# EAGLE design TwoArmedBandit_old (EAGLE 9.6.2)
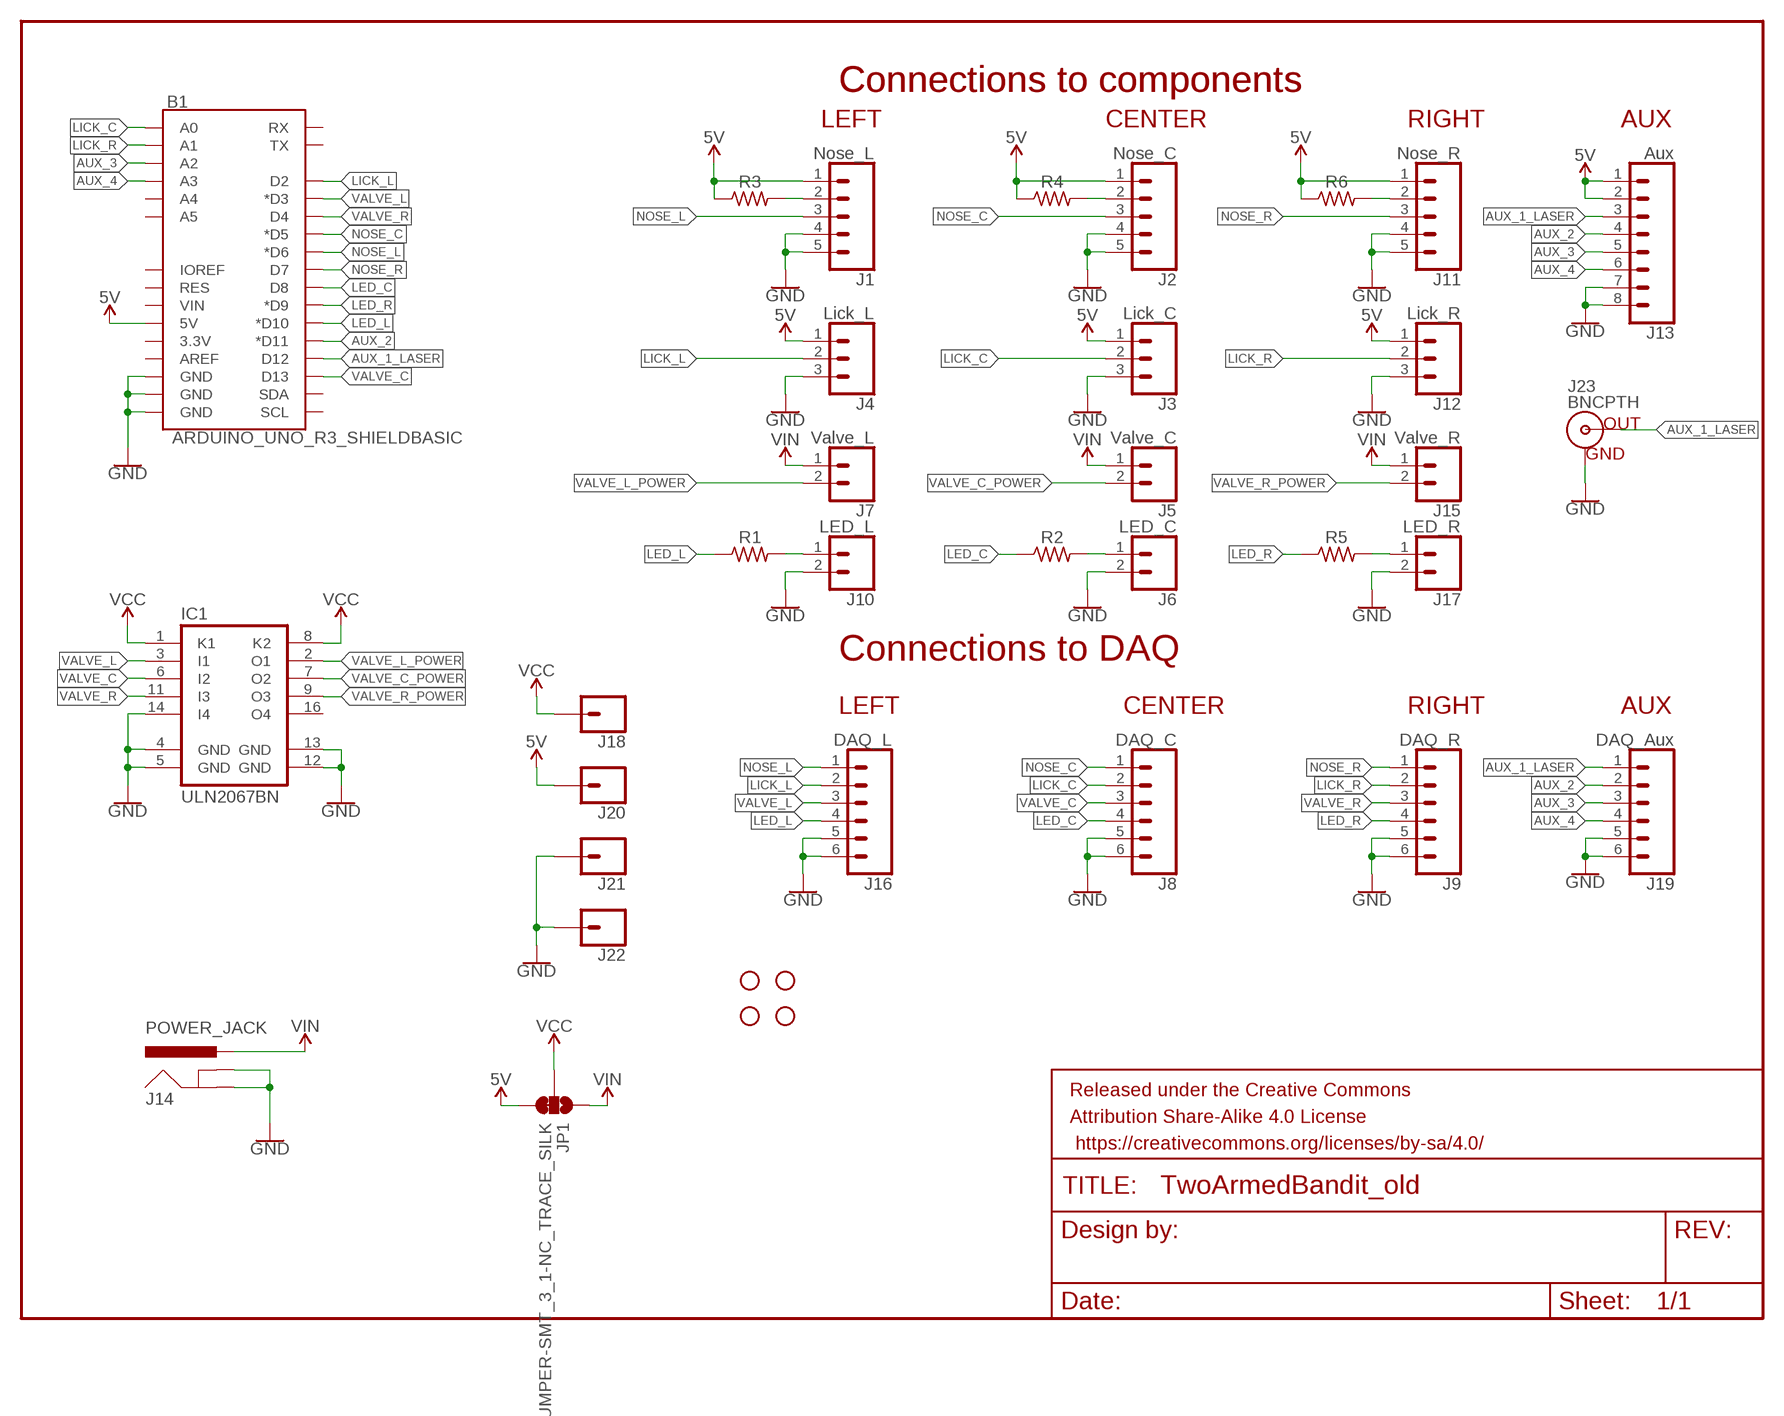
[diagram p0: schematic, sheet 1]

## Parts
B1  ARDUINO_UNO_R3_SHIELDBASIC  [UNO_R3_SHIELD]
FRAME1  FRAME-LETTERNO_PACKAGE  [DUMMY]
H1  STAND-OFF  [STAND-OFF]
H2  STAND-OFF  [STAND-OFF]
H3  STAND-OFF  [STAND-OFF]
H4  STAND-OFF  [STAND-OFF]
IC1  ULN2067BN  [DIL16]
J1  Nose_L  CONN_05SCREW  [SCREWTERMINAL-3.5MM-5]
J2  Nose_C  CONN_05SCREW  [SCREWTERMINAL-3.5MM-5]
J3  Lick_C  CONN_03  [1X03]
J4  Lick_L  CONN_03  [1X03]
J5  Valve_C  CONN_02  [1X02]
J6  LED_C  CONN_02  [1X02]
J7  Valve_L  CONN_02  [1X02]
J8  DAQ_C  CONN_063.5MM-6  [SCREWTERMINAL-3.5MM-6]
J9  DAQ_R  CONN_063.5MM-6  [SCREWTERMINAL-3.5MM-6]
J10  LED_L  CONN_02  [1X02]
J11  Nose_R  CONN_05SCREW  [SCREWTERMINAL-3.5MM-5]
J12  Lick_R  CONN_03  [1X03]
J13  Aux  CONN_08"  [1X08]
J14  POWER_JACK  [POWER_JACK_PTH]
J15  Valve_R  CONN_02  [1X02]
J16  DAQ_L  CONN_063.5MM-6  [SCREWTERMINAL-3.5MM-6]
J17  LED_R  CONN_02  [1X02]
J18  CONN_01PTH_2MM  [1X01_2MM]
J19  DAQ_Aux  CONN_063.5MM-6  [SCREWTERMINAL-3.5MM-6]
J20  CONN_01PTH_2MM  [1X01_2MM]
J21  CONN_01PTH_2MM  [1X01_2MM]
J22  CONN_01PTH_2MM  [1X01_2MM]
J23  BNCPTH  [BNC]
JP1  JUMPER-SMT_3_1-NC_TRACE_SILK  [SMT-JUMPER_3_1-NC_TRACE_SILK]
R1  330  R-US_0309/12  [0309/12]
R2  330  R-US_0309/12  [0309/12]
R3  160  R-US_0309/12  [0309/12]
R4  160  R-US_0309/12  [0309/12]
R5  330  R-US_0309/12  [0309/12]
R6  160  R-US_0309/12  [0309/12]

## Nets
5V [power]: B1.5V J1.1 J2.1 J3.1 J4.1 J11.1 J12.1 J13.1 J13.2 J20.1 JP1.3 R3.1 R4.1 R6.1
AUX_1_LASER: B1.D12 J13.3 J19.1 J23.S(OUT)
AUX_2: B1.D11(*D11) J13.4 J19.2
AUX_3: B1.A2 J13.5 J19.3
AUX_4: B1.A3 J13.6 J19.4
GND [power]: B1.GND@0(GND) B1.GND@1(GND) B1.GND@2(GND) IC1.4(GND) IC1.5(GND) IC1.12(GND) IC1.13(GND) IC1.14(I4) J1.4 J1.5 J2.4 J2.5 J3.3 J4.3 J6.2 J8.5 J8.6 J9.5 J9.6 J10.2 J11.4 J11.5 J12.3 J13.7 J13.8 J14.GND J14.GNDBREAK J16.5 J16.6 J17.2 J19.5 J19.6 J21.1 J22.1 J23.GND
LED_C: B1.D8 J8.4 R2.1
LED_L: B1.D10(*D10) J16.4 R1.1
LED_R: B1.D9(*D9) J9.4 R5.1
LICK_C: B1.A0 J3.2 J8.2
LICK_L: B1.D2 J4.2 J16.2
LICK_R: B1.A1 J9.2 J12.2
N$1: J2.2 R4.2
N$2: J1.2 R3.2
N$3: J6.1 R2.2
N$4: J11.2 R6.2
N$5: J17.1 R5.2
N$11: J10.1 R1.2
NOSE_C: B1.D5(*D5) J2.3 J8.1
NOSE_L: B1.D6(*D6) J1.3 J16.1
NOSE_R: B1.D7 J9.1 J11.3
VALVE_C: B1.D13 IC1.6(I2) J8.3
VALVE_C_POWER [power]: IC1.7(O2) J5.2
VALVE_L: B1.D3(*D3) IC1.3(I1) J16.3
VALVE_L_POWER [power]: IC1.2(O1) J7.2
VALVE_R: B1.D4 IC1.11(I3) J9.3
VALVE_R_POWER [power]: IC1.9(O3) J15.2
VCC [power]: IC1.1(K1) IC1.8(K2) J18.1 JP1.2
VIN [power]: J5.1 J7.1 J14.PWR J15.1 JP1.1
Unconnected: B1.3.3V B1.A4 B1.A5 B1.AREF B1.IOREF B1.RES B1.RX B1.SCL B1.SDA B1.TX B1.VIN IC1.16(O4)

## Notes on the sheet
- Connections to components | Connections to components
- LEFT | CENTER | RIGHT | AUX
- Connections to DAQ
- LEFT | CENTER | RIGHT | AUX

## Library data of the parts
B1 = SparkFun-Boards:ARDUINO_UNO_R3_SHIELD: Arduino R3 Shield Footprint Shield form compatible with the Arduino Uno R3. SparkFun Products: MG2639 Cellular Shield <https://www.sparkfun.com/products/13120> MIDI Shield <https://www.sparkfun.com/products/12898> R3 Stackable Headers Kit <https://www.sparkfun.com/products/11417>
FRAME1 = SparkFun-Aesthetics:FRAME-LETTER: Schematic Frame - Letter Standard 8.5x11 US Letter frame; DESIGNER: Nobody; VERSION: v01
H1-H4 = SparkFun-Hardware:STAND-OFF: Stand Off Drill holes for mechanically mounting via screws, standoffs, etc. Note: Use the keepout ring to avoid running the screw head into surrounding components. Variant Overviews STAND-OFF - Mechanical footprint for a #4 phillips button head screw. STAND-OFF-TIGHT - Mechanical footprint for a #4 phillips button head screw, Example SparkFun Products Screw - Phillips Head (1/4", 4-40, 10 pack) <https://www.sparkfun.com/products/10453> (PRT-10453) Screw - Phillips Head (1/2", 4-40, 10 pack) <https://www.sparkfun.com/products/10452> (PRT-10452) Screw - Phillips Head (3/4", 4-40, 10 pack) <https://www.sparkfun.com/products/10451> (PRT-10451) Screw - Phillips Head (1", 4-40, 10 pack) <https://www.sparkfun.com/products/10450> (PRT-10450)
IC1 = uln-udn:ULN2067B: DRIVER ARRAY
J1 J2 J11 = SparkFun-Connectors:CONN_05: Multi connection point. Often used as Generic Header-pin footprint for 0.1 inch spaced/style header connections On any of the 0.1 inch spaced packages, you can populate with these: Break Away Headers - Straight <https://www.sparkfun.com/products/116> (PRT-00116) Break Away Male Headers - Right Angle <https://www.sparkfun.com/products/553> (PRT-00553) Female Headers <https://www.sparkfun.com/products/115> (PRT-00115) Break Away Headers - Machine Pin <https://www.sparkfun.com/products/117> (PRT-00117) Break Away Female Headers - Swiss Machine Pin <https://www.sparkfun.com/products/743> (PRT-00743) For SCREWTERMINALS and SPRING TERMINALS visit here: Screw Terimnals on SparkFun.com <https://www.sparkfun.com/search/results?term=Screw+Terminals> (5mm/3.5mm/2.54mm spacing) This device is also useful as a general connection point to wire up your design to another part of your project. Our various solder wires solder well into these plated through hole pads. Hook-Up Wire - Assortment (Stranded, 22 AWG) <https://www.sparkfun.com/products/11375> (PRT-11375) Hook-Up Wire - Assortment (Solid Core, 22 AWG) <https://www.sparkfun.com/products/11367> (PRT-11367) View the entire wire category on our website here <https://www.sparkfun.com/categories/141> Special notes: Molex polarized connector foot print use with SKU : PRT-08231 with associated crimp pins and housings. 1MM SMD Version SKU: PRT-10208; PROD_ID: Combine 8288+8399
J3 J4 J12 = SparkFun-Connectors:CONN_03: Multi connection point. Often used as Generic Header-pin footprint for 0.1 inch spaced/style header connections On any of the 0.1 inch spaced packages, you can populate with these: Break Away Headers - Straight <https://www.sparkfun.com/products/116> (PRT-00116) Break Away Male Headers - Right Angle <https://www.sparkfun.com/products/553> (PRT-00553) Female Headers <https://www.sparkfun.com/products/115> (PRT-00115) Break Away Headers - Machine Pin <https://www.sparkfun.com/products/117> (PRT-00117) Break Away Female Headers - Swiss Machine Pin <https://www.sparkfun.com/products/743> (PRT-00743) Stackable Header - 3 Pin (Female, 0.1") <https://www.sparkfun.com/products/13875> (PRT-13875) For SCREWTERMINALS and SPRING TERMINALS visit here: Screw Terimnals on SparkFun.com <https://www.sparkfun.com/search/results?term=Screw+Terminals> (5mm/3.5mm/2.54mm spacing) This device is also useful as a general connection point to wire up your design to another part of your project. Our various solder wires solder well into these plated through hole pads. Hook-Up Wire - Assortment (Stranded, 22 AWG) <https://www.sparkfun.com/products/11375> (PRT-11375) Hook-Up Wire - Assortment (Solid Core, 22 AWG) <https://www.sparkfun.com/products/11367> (PRT-11367) View the entire wire category on our website here <https://www.sparkfun.com/categories/141> Special notes: Molex polarized connector foot print use with SKU : PRT-08232 with associated crimp pins and housings.
J5-J7 J10 J15 J17 = SparkFun-Connectors:CONN_02: Multi connection point. Often used as Generic Header-pin footprint for 0.1 inch spaced/style header connections On any of the 0.1 inch spaced packages, you can populate with these: Break Away Headers - Straight <https://www.sparkfun.com/products/116> (PRT-00116) Break Away Male Headers - Right Angle <https://www.sparkfun.com/products/553> (PRT-00553) Female Headers <https://www.sparkfun.com/products/115> (PRT-00115) Break Away Headers - Machine Pin <https://www.sparkfun.com/products/117> (PRT-00117) Break Away Female Headers - Swiss Machine Pin <https://www.sparkfun.com/products/743> (PRT-00743) For SCREWTERMINALS and SPRING TERMINALS visit here: Screw Terimnals on SparkFun.com <https://www.sparkfun.com/search/results?term=Screw+Terminals> (5mm/3.5mm/2.54mm spacing) This device is also useful as a general connection point to wire up your design to another part of your project. Our various solder wires solder well into these plated through hole pads. Hook-Up Wire - Assortment (Stranded, 22 AWG) <https://www.sparkfun.com/products/11375> (PRT-11375) Hook-Up Wire - Assortment (Solid Core, 22 AWG) <https://www.sparkfun.com/products/11367> (PRT-11367) View the entire wire category on our website here <https://www.sparkfun.com/categories/141> Special notes: Molex polarized connector foot print use with: PRT-08233 with associated crimp pins and housings. 2.54_SCREWTERM for use with PRT-10571. 3.5mm Screw Terminal footprints for PRT-08084 5mm Screw Terminal footprints for use with PRT-08432
J8 J9 J16 J19 = SparkFun-Connectors:CONN_06: Multi connection point. Often used as Generic Header-pin footprint for 0.1 inch spaced/style header connections On any of the 0.1 inch spaced packages, you can populate with these: Break Away Headers - Straight <https://www.sparkfun.com/products/116> (PRT-00116) Break Away Male Headers - Right Angle <https://www.sparkfun.com/products/553> (PRT-00553) Female Headers <https://www.sparkfun.com/products/115> (PRT-00115) Break Away Headers - Machine Pin <https://www.sparkfun.com/products/117> (PRT-00117) Break Away Female Headers - Swiss Machine Pin <https://www.sparkfun.com/products/743> (PRT-00743) Arduino Stackable Header - 6 Pin <https://www.sparkfun.com/products/9280> (PRT-09280) For SCREWTERMINALS and SPRING TERMINALS visit here: Screw Terimnals on SparkFun.com <https://www.sparkfun.com/search/results?term=Screw+Terminals> (5mm/3.5mm/2.54mm spacing) This device is also useful as a general connection point to wire up your design to another part of your project. Our various solder wires solder well into these plated through hole pads. Hook-Up Wire - Assortment (Stranded, 22 AWG) <https://www.sparkfun.com/products/11375> (PRT-11375) Hook-Up Wire - Assortment (Solid Core, 22 AWG) <https://www.sparkfun.com/products/11367> (PRT-11367) View the entire wire category on our website here <https://www.sparkfun.com/categories/141>
J13 = SparkFun-Connectors:CONN_08: Multi connection point. Often used as Generic Header-pin footprint for 0.1 inch spaced/style header connections On any of the 0.1 inch spaced packages, you can populate with these: Break Away Headers - Straight <https://www.sparkfun.com/products/116> (PRT-00116) Break Away Male Headers - Right Angle <https://www.sparkfun.com/products/553> (PRT-00553) Female Headers <https://www.sparkfun.com/products/115> (PRT-00115) Break Away Headers - Machine Pin <https://www.sparkfun.com/products/117> (PRT-00117) Break Away Female Headers - Swiss Machine Pin <https://www.sparkfun.com/products/743> (PRT-00743) Arduino Stackable Header - 8 Pin <https://www.sparkfun.com/products/9279> (PRT-09279) For SCREWTERMINALS and SPRING TERMINALS visit here: Screw Terimnals on SparkFun.com <https://www.sparkfun.com/search/results?term=Screw+Terminals> (5mm/3.5mm/2.54mm spacing) This device is also useful as a general connection point to wire up your design to another part of your project. Our various solder wires solder well into these plated through hole pads. Hook-Up Wire - Assortment (Stranded, 22 AWG) <https://www.sparkfun.com/products/11375> (PRT-11375) Hook-Up Wire - Assortment (Solid Core, 22 AWG) <https://www.sparkfun.com/products/11367> (PRT-11367) View the entire wire category on our website here <https://www.sparkfun.com/categories/141> Special notes: Molex polarized connector foot print use with SKU : PRT-08231 with associated crimp pins and housings. 1MM SMD Version SKU: PRT-10208 NOTES ON THE VARIANTS LOCK and LOCK_LONGPADS... This footprint was designed to help hold the alignment of a through-hole component (i.e. 6-pin header) while soldering it into place. You may notice that each hole has been shifted either up or down by 0.005 of an inch from it's more standard position (which is a perfectly straight line). This slight alteration caused the pins (the squares in the middle) to touch the edges of the holes. Because they are alternating, it causes a "brace" to hold the component in place. 0.005 has proven to be the perfect amount of "off-center" position when using our standard breakaway headers. Although looks a little odd when you look at the bare footprint, once you have a header in there, the alteration is very hard to notice. Also,if you push a header all the way into place, it is covered up entirely on the bottom side.; PROD_ID: CONN-08438
J14 = SparkFun-Connectors:POWER_JACK: Power Jack Connector This is the standard 5.5mm barrel jack for power. The PTH is the most common, proven, reliable, footprint. The Slot footprint only works if the mill layer is transmitted to the PCB fab house so be warned. Here are the connectors we sell at SparkFun: DC Barrel Power Jack/Connector <https://www.sparkfun.com/products/119> (PRT-00119) DC Barrel Power Jack/Connector (SMD) <https://www.sparkfun.com/products/12748> (PRT-12748) DC Barrel Jack Adapter - Breadboard Compatible <https://www.sparkfun.com/products/10811> (PRT-10811) It is used on this SparkFun product (and many, many others): SparkFun RedBoard - Programmed with Arduino <https://www.sparkfun.com/products/12757> (DEV-12757) Also, if you need a mating power supply or connector, please check these out: Wall Adapter Power Supply - 9VDC 650mA <https://www.sparkfun.com/products/298> (TOL-00298) DC Barrel Jack Adapter - Male <https://www.sparkfun.com/products/10287> (PRT-10287); PROD_ID: CONN-08197
J18 J20-J22 = SparkFun-Connectors:CONN_01: Single connection point. Often used as Generic Header-pin footprint for 0.1 inch spaced/style header connections On any of the 0.1 inch spaced packages, you can populate with these: Break Away Headers - Straight <https://www.sparkfun.com/products/116> (PRT-00116) Break Away Male Headers - Right Angle <https://www.sparkfun.com/products/553> (PRT-00553) Female Headers <https://www.sparkfun.com/products/115> (PRT-00115) Break Away Headers - Machine Pin <https://www.sparkfun.com/products/117> (PRT-00117) Break Away Female Headers - Swiss Machine Pin <https://www.sparkfun.com/products/743> (PRT-00743) This device is also useful as a general connection point to wire up your design to another part of your project. Our various solder wires solder well into these plated through hole pads. Hook-Up Wire - Assortment (Stranded, 22 AWG) <https://www.sparkfun.com/products/11375> (PRT-11375) Hook-Up Wire - Assortment (Solid Core, 22 AWG) <https://www.sparkfun.com/products/11367> (PRT-11367) View the entire wire category on our website here <https://www.sparkfun.com/categories/141> Special notes: SMTSO-256-ET is a "flush mount" nut for a 4-40 screw. We mostly use this on specialty testbeds; it is a nice way to connect hardware to your PCB at an adjustable hieght. Also note, the SNAP packages are for using a snappable style connector. We sell a baggie of snaps and they are also used on two LilyPad designs: Snap Assortment - 30 pack (male and female) <https://www.sparkfun.com/products/11347> (DEV-11347) LilyPad Arduino SimpleSnap <https://www.sparkfun.com/products/10941> (DEV-10941) LilyPad SimpleSnap Protoboard <https://www.sparkfun.com/products/10940> (DEV-10940)
J23 = SparkFun-Connectors:BNC: BNC Right Angle Connector Mouser Part# 5227161 SparkFun Products: BNC Connector - Right Angle <https://www.sparkfun.com/products/10550>; PROD_ID: LPA-12729; SF_ID: PRT-10550
JP1 = SparkFun-Jumpers:JUMPER-SMT_3_1-NC_TRACE: Normally closed trace jumper (1 of 2 connections) This jumper has a trace between two pads so it's normally closed (NC). The other connection is normally open (NO). Use a razor knife to open the connection. For best results follow the IPC guidelines for cutting traces: Cutout at least 0.063 mm (0.005 in). Remove all loose material to clean up the cut area. Seal the cut with an approved epoxy. Reapply solder to reclose the connection, or to close the NO connection.
R1-R6 = rcl:R-US_: RESISTOR, American symbol; SPICEPREFIX: R

## Net classes
0 default: width 0.305 mm
1 power: width 1.27 mm

## Board
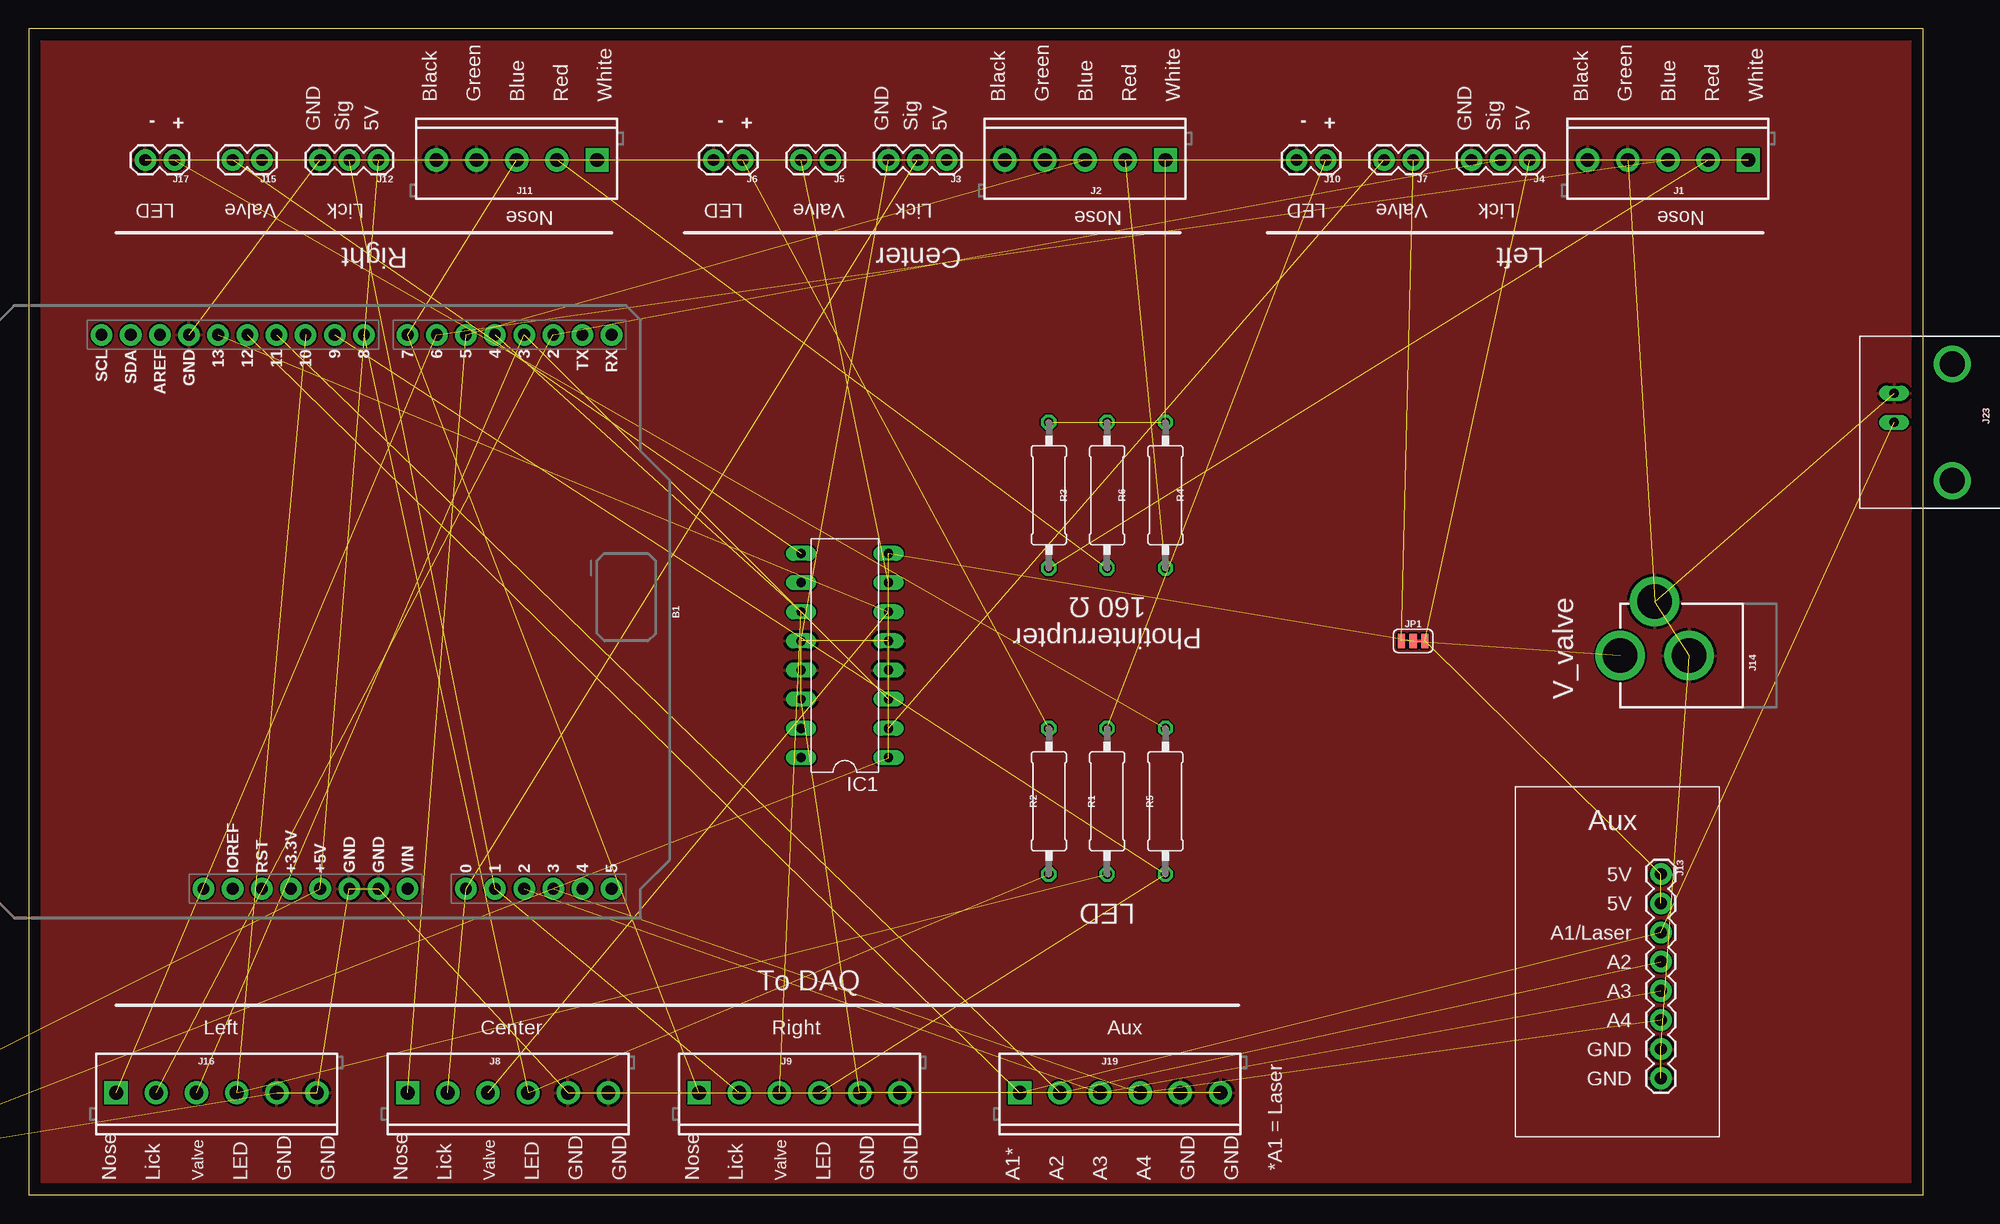
[diagram p1: board, top side]
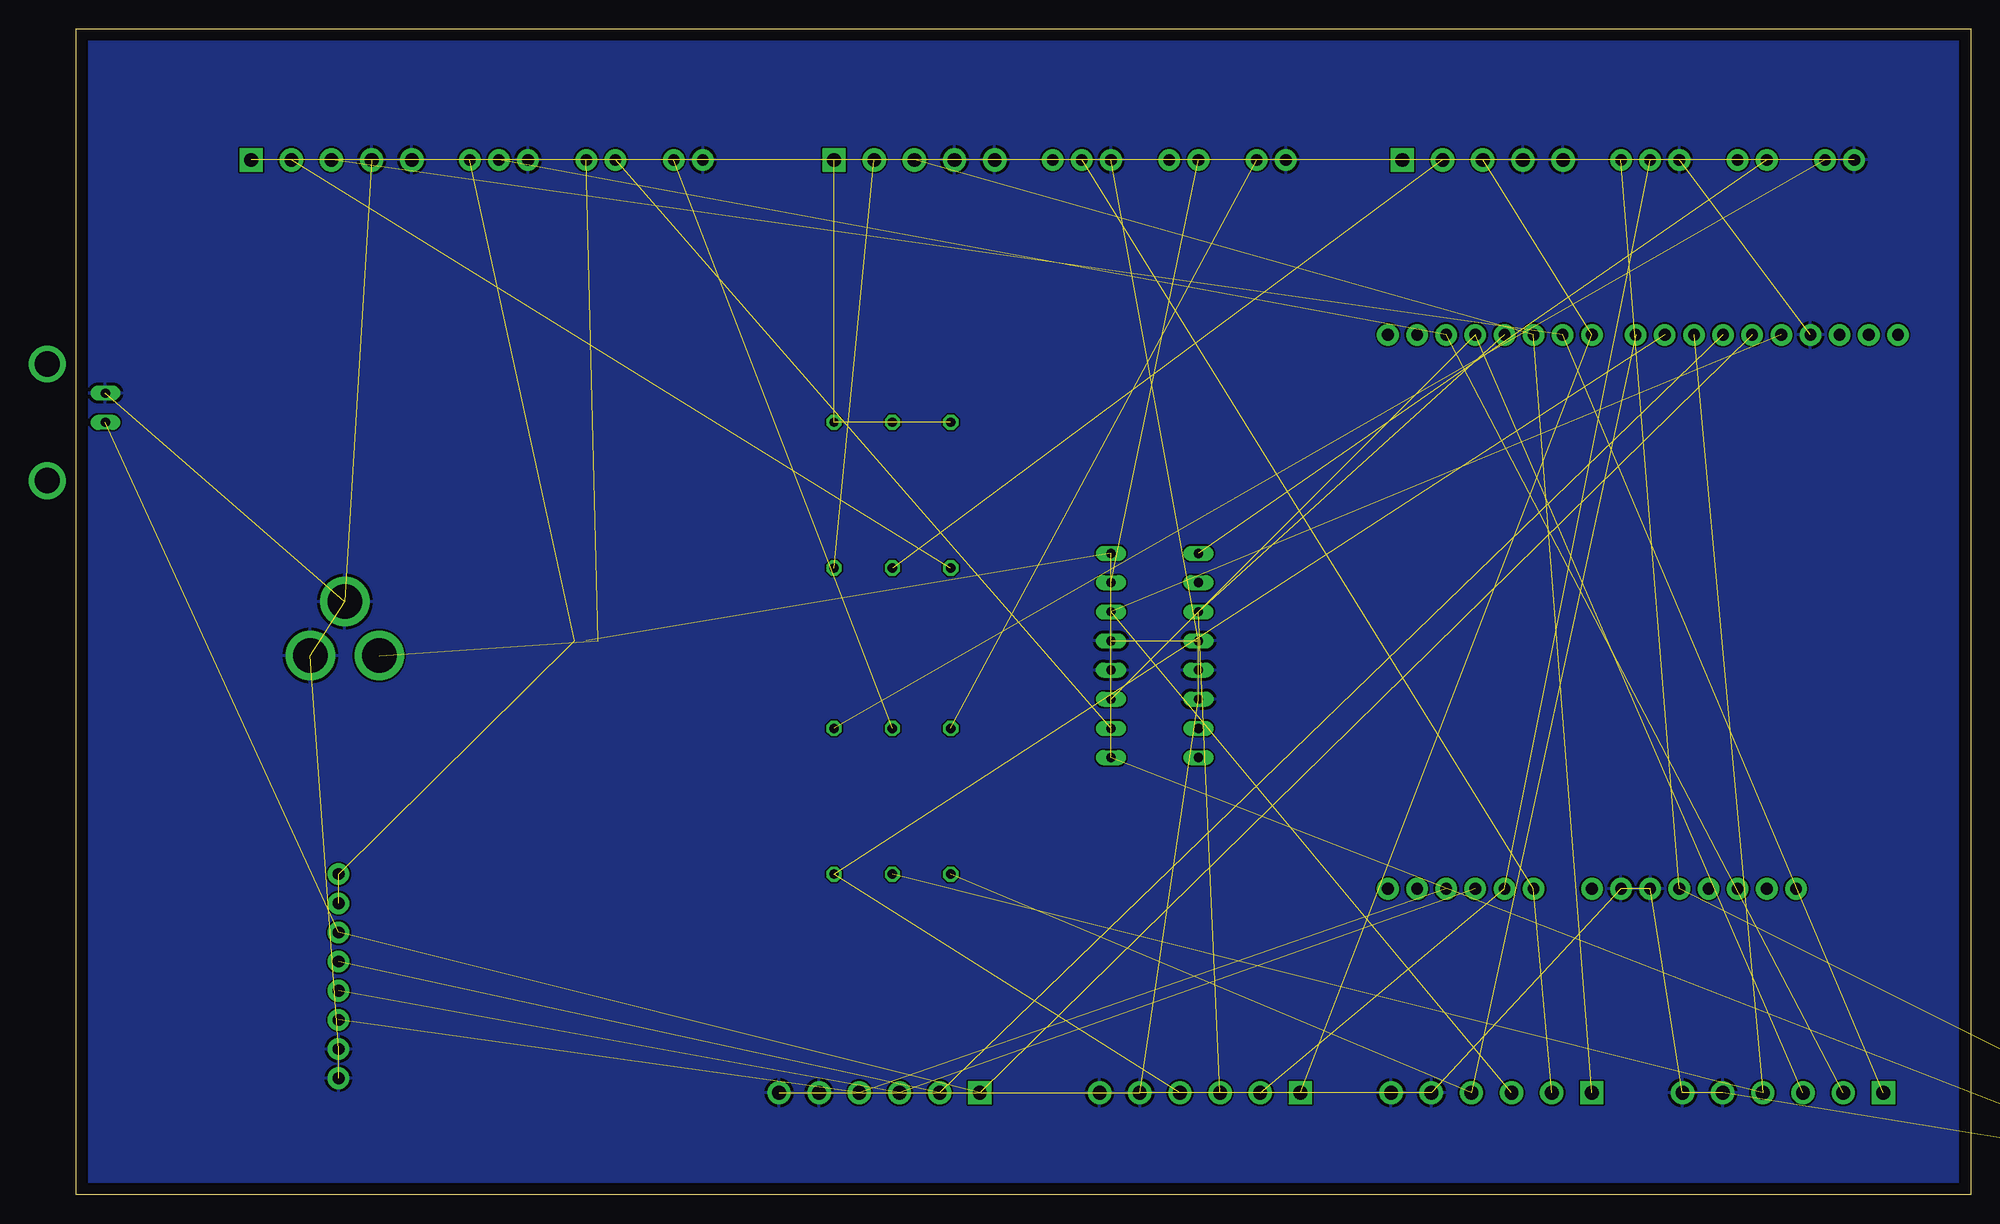
[diagram p2: board, bottom side, seen from below]

Size 165.1 x 101.6 mm. Coordinates in mm from the lower left corner, seen from the top.
Outline: 0,0 165.1,0 165.1,101.6 0,101.6 0,0
Copper layers (1*16): Top 0.035mm / dielectric 1.5mm / Bottom 0.035mm
Design rules "default": minimum track width 6mil, minimum drill 0.35mm, track to track 6mil, track to pad 6mil, pad to pad 6mil, via to via 6mil, smd to smd 6mil, copper to edge 40mil, drill to drill 6mil, minimum pad ring 10mil, minimum via ring 8mil, stop-mask expansion 4mil, vias tented up to drill 0mil, thermal gap 10mil

### Footprints (pad centres in the part's own frame; a part is rotated, then mirrored left to right if it is on the bottom)
UNO_R3_SHIELD = drill 1.016 pad 1.88: 3.3V 24.13,-2.54; 5V 24.13,0; A0 24.13,12.7; A1 24.13,15.24; A2 24.13,17.78; A3 24.13,20.32; A4 24.13,22.86; A5 24.13,25.4; AREF -24.13,-13.97; D2 -24.13,20.32; D3 -24.13,17.78; D4 -24.13,15.24; D5 -24.13,12.7; D6 -24.13,10.16; D7 -24.13,7.62; D8 -24.13,3.81; D9 -24.13,1.27; D10 -24.13,-1.27; D11 -24.13,-3.81; D12 -24.13,-6.35; D13 -24.13,-8.89; GND@0 24.13,2.54; GND@1 24.13,5.08; GND@2 -24.13,-11.43; IOREF 24.13,-7.62; NC 24.13,-10.16; RES 24.13,-5.08; RX -24.13,25.4; SCL -24.13,-19.05; SDA -24.13,-16.51; TX -24.13,22.86; VIN 24.13,7.62
STAND-OFF = hole 3.302: 0,0
DIL16 = drill 0.813 long: 1 -8.89,-3.81; 2 -6.35,-3.81; 3 -3.81,-3.81; 4 -1.27,-3.81; 5 1.27,-3.81; 6 3.81,-3.81; 7 6.35,-3.81; 8 8.89,-3.81; 9 8.89,3.81; 10 6.35,3.81; 11 3.81,3.81; 12 1.27,3.81; 13 -1.27,3.81; 14 -3.81,3.81; 15 -6.35,3.81; 16 -8.89,3.81
SCREWTERMINAL-3.5MM-5 = drill 1.2 pad 2.032 square: 1 0,0 | drill 1.2 pad 2.032: 2 3.5,0; 3 7,0; 4 10.5,0; 5 14,0
1X03 = drill 1.016 pad 1.88: 1 0,0; 2 2.54,0; 3 5.08,0
1X02 = drill 1.016 pad 1.88: 1 0,0; 2 2.54,0
SCREWTERMINAL-3.5MM-6 = drill 1.2 pad 2.032 square: 1 0,0 | drill 1.2 pad 2.032: 2 3.5,0; 3 7,0; 4 10.5,0; 5 14,0; 6 17.5,0
1X08 = drill 1.016 pad 1.88: 1 0,0; 2 2.54,0; 3 5.08,0; 4 7.62,0; 5 10.16,0; 6 12.7,0; 7 15.24,0; 8 17.78,0
POWER_JACK_PTH = drill 2.997 pad 4.318: GND 0,7.7; GNDBREAK 4.7,10.7; PWR 0,13.7
1X01_2MM = drill 2 pad 3.302: 1 0,0
BNC = drill 2.2: 3 -5.08,5.08; 4 5.08,5.08 | drill 0.8 long: GND -2.54,0; S 0,0
SMT-JUMPER_3_1-NC_TRACE_SILK = smd 0.635 x 1.27: 1 -1.016,0; 2 0,0; 3 1.016,0
0309/12 = drill 0.813 octagon: 1 -6.35,0; 2 6.35,0

### Placement (x,y rotation side)
B1  25.4,50.8 270 top
FRAME1  -5.08,-2.54 180 top  (outside the outline)
H1  -43.18,0 0 top  (outside the outline)
H2  -49.53,0 0 top  (outside the outline)
H3  -12.7,88.9 0 top  (outside the outline)
H4  -21.59,12.7 0 top  (outside the outline)
IC1  71.12,46.99 90 top
J1  149.86,90.17 180 top
J2  99.06,90.17 180 top
J3  80.01,90.17 180 top
J4  130.81,90.17 180 top
J5  69.85,90.17 180 top
J6  62.23,90.17 180 top
J7  120.65,90.17 180 top
J8  33.02,8.89 0 top
J9  58.42,8.89 0 top
J10  113.03,90.17 180 top
J11  49.53,90.17 180 top
J12  30.48,90.17 180 top
J13  142.24,27.94 270 top
J14  152.4,46.99 90 top
J15  20.32,90.17 180 top
J16  7.62,8.89 0 top
J17  12.7,90.17 180 top
J18  -22.86,0 0 top  (outside the outline)
J19  86.36,8.89 0 top
J20  -27.94,0 0 top  (outside the outline)
J21  -33.02,0 0 top  (outside the outline)
J22  -38.1,0 0 top  (outside the outline)
J23  162.56,67.31 270 top
JP1  120.65,48.26 0 top
R1  93.98,34.29 90 top
R2  88.9,34.29 90 top
R3  88.9,60.96 270 top
R4  99.06,60.96 270 top
R5  99.06,34.29 90 top
R6  93.98,60.96 270 top

### Tracks (layer width: path | path; a pad name or v marks a point on that pad's centre or on a via)
5V  (13 unrouted)
AUX_1_LASER  (3 unrouted)
AUX_2  (2 unrouted)
AUX_3  (2 unrouted)
AUX_4  (2 unrouted)
GND  (34 unrouted)
  pour Top: 0,101.6 0,0 165.1,0 165.1,101.6
  pour Bottom: 0,101.6 0,0 165.1,0 165.1,101.6
LED_C  (2 unrouted)
LED_L  (2 unrouted)
LED_R  (2 unrouted)
LICK_C  (2 unrouted)
LICK_L  (2 unrouted)
LICK_R  (2 unrouted)
N$1  (1 unrouted)
N$2  (1 unrouted)
N$3  (1 unrouted)
N$4  (1 unrouted)
N$5  (1 unrouted)
N$11  (1 unrouted)
NOSE_C  (2 unrouted)
NOSE_L  (2 unrouted)
NOSE_R  (2 unrouted)
VALVE_C  (2 unrouted)
VALVE_C_POWER  (1 unrouted)
VALVE_L  (2 unrouted)
VALVE_L_POWER  (1 unrouted)
VALVE_R  (2 unrouted)
VALVE_R_POWER  (1 unrouted)
VCC  (3 unrouted)
VIN  (4 unrouted)

### Text on the board
tPlace: Black | Green | Blue | Red | White | Black | Green | Blue | Red | White | Black | Green | Blue | Red | White | + - | + - | + - | GND | Sig | 5V | GND | Sig | 5V | GND | Sig | 5V | LED | Valve | Lick | Nose | LED | Valve | Lick | Nose | LED | Valve | Lick | Nose | Right | Center | Left | Photinterrupter / 160 Ω | V_valve | Aux | 5V | 5V | LED | A1/Laser | A2 | To DAQ | A3 | A4 | Left | Center | Right | Aux | GND | *A1 = Laser | GND | Nose | Lick | Valve | LED | GND | GND | Nose | Lick | Valve | LED | GND | GND | Nose | Lick | Valve | LED | GND | GND | A1* | A2 | A3 | A4 | GND | GND